# Altium schematic sheet 04_FMC.SchDoc: Power
size A3; Organization: Lime Microsystems; Address1: Surrey Tech Centre; Address2: Guildford GU2 7YG; Address3: Surrey; Address4: United Kingdom; Revision: v1.1; SheetNumber: 12; SheetTotal: 12
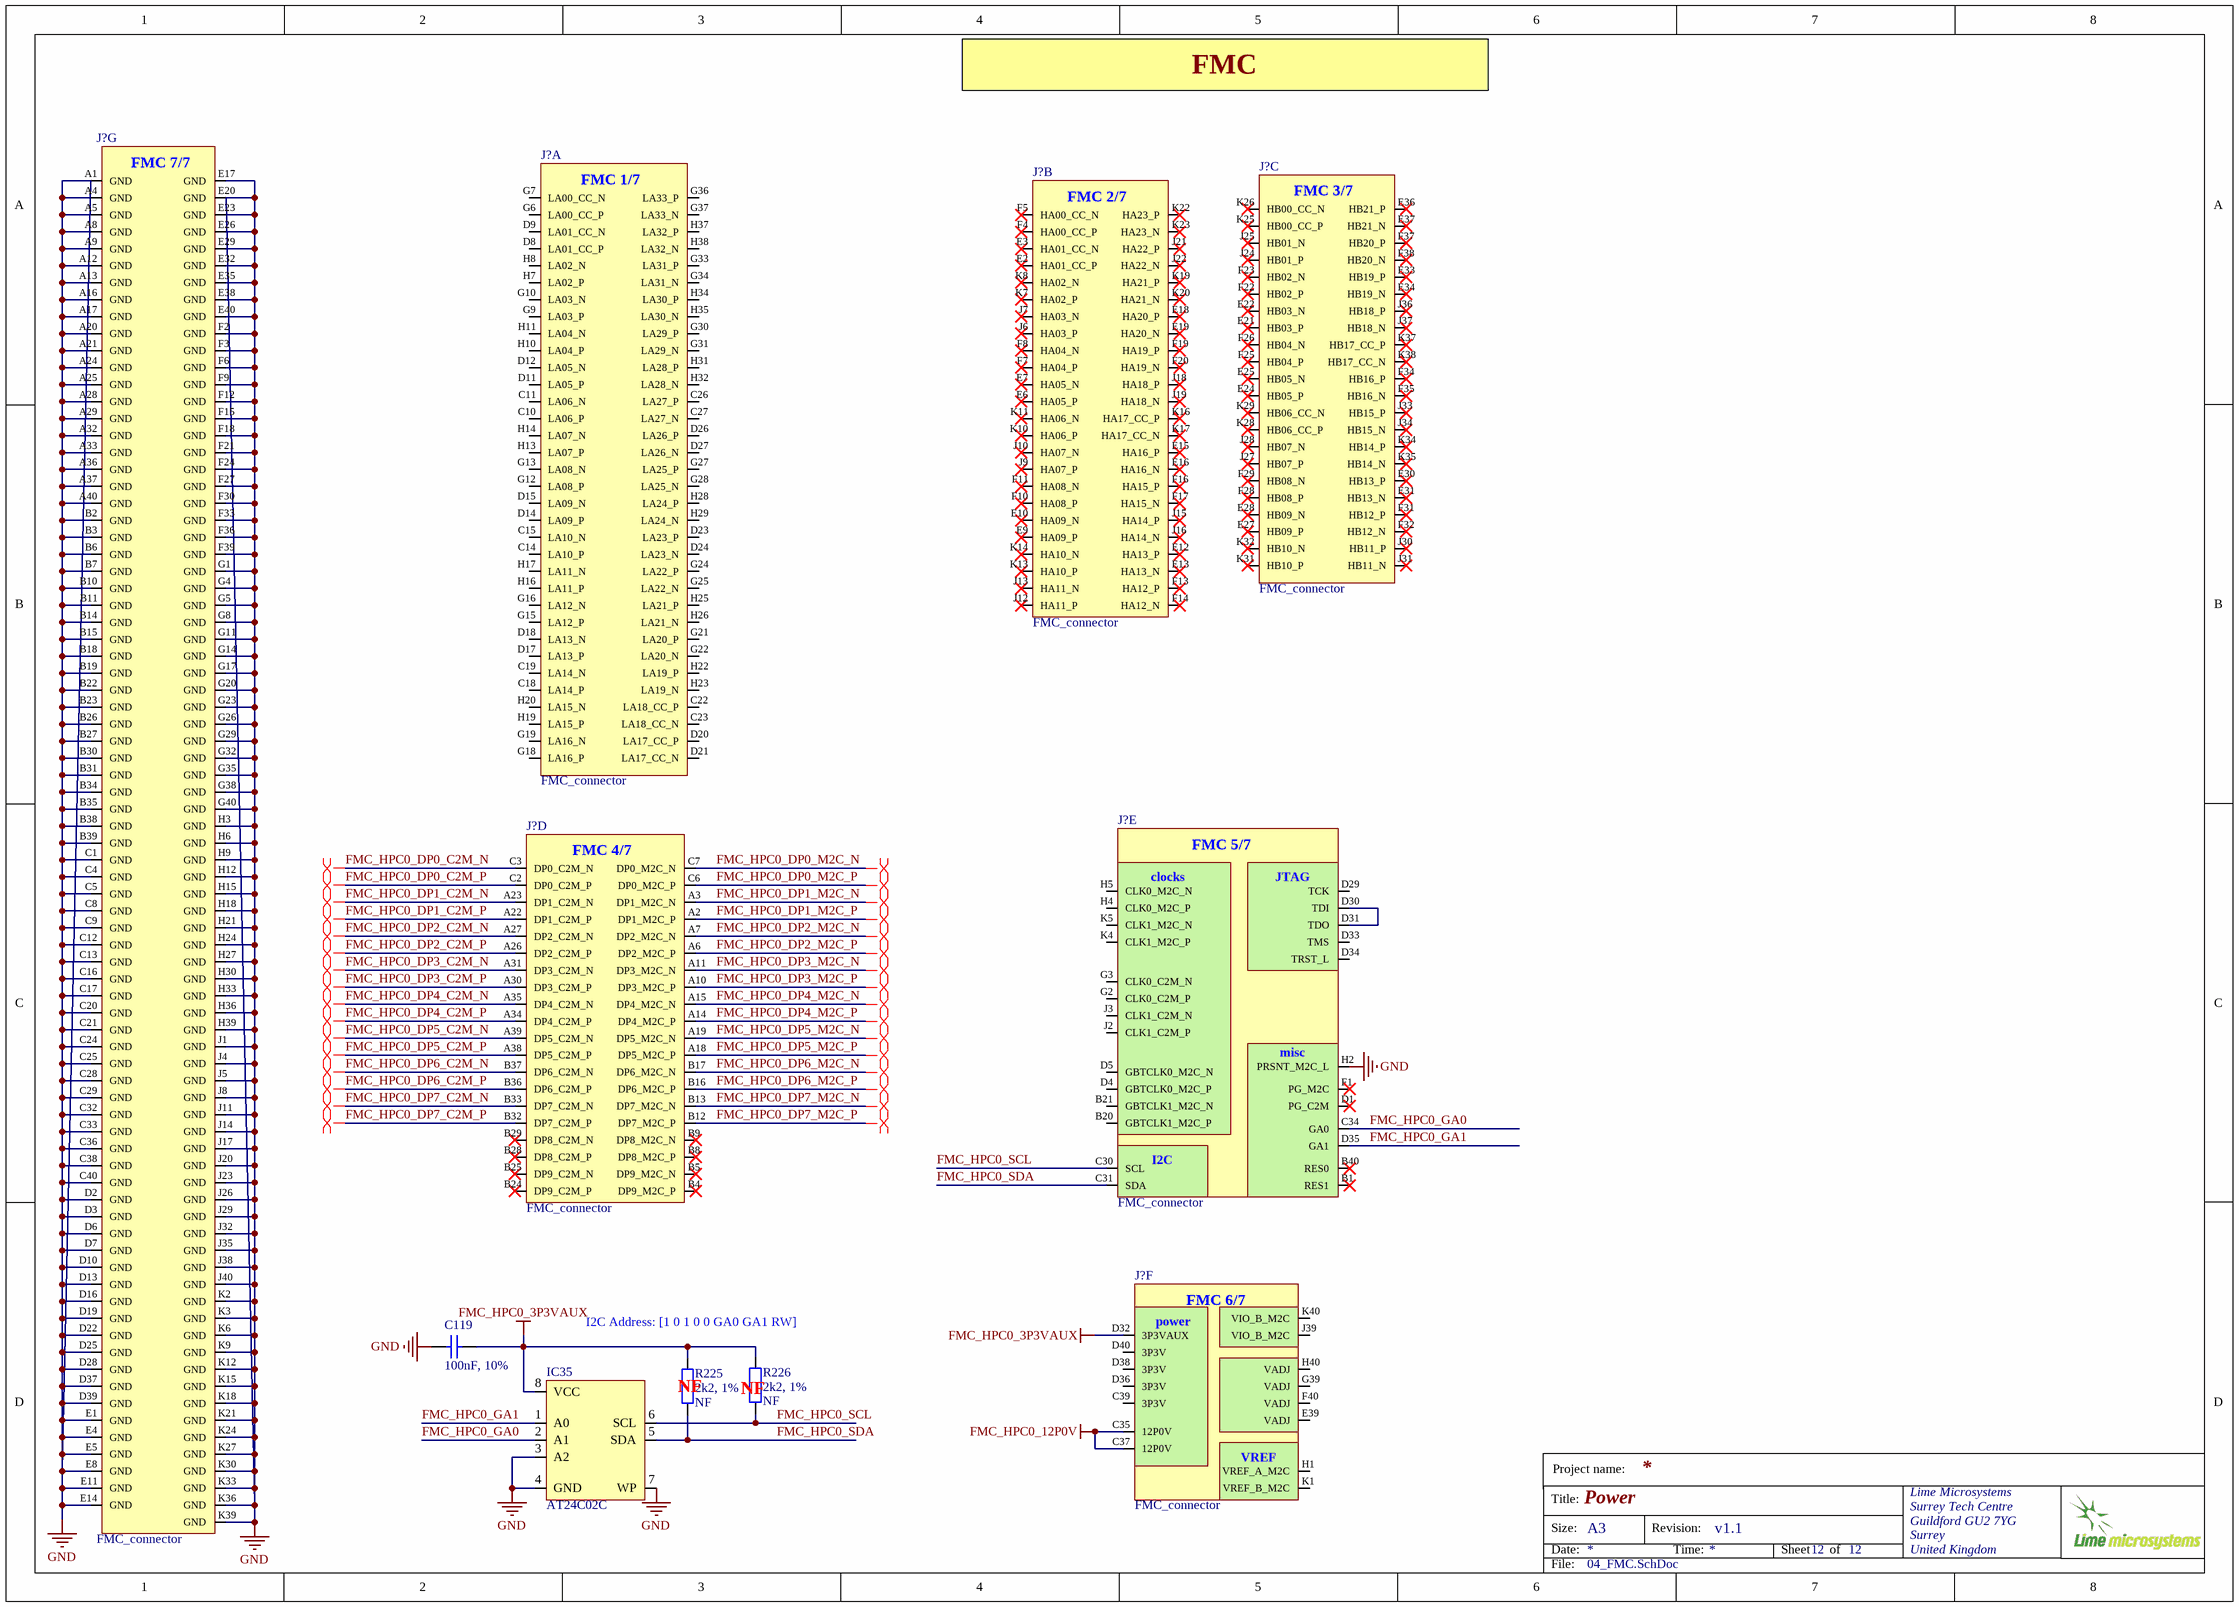
[diagram p0: 04_FMC.SchDoc]

## Parts
(Parts that share a designator on the sheet are numbered #1, #2 ... from top to bottom, then left to right.)
C119  100nF, 10%  [CAP0402]
IC35  AT24C02C  [SOIC127P600-8DL_v2]
J?#1  FMC_connector  [FMC_full_conn]  (part A of 7)
J?#2  FMC_connector  [FMC_full_conn]  (part B of 7)
J?#3  FMC_connector  [FMC_full_conn]  (part C of 7)
J?#4  FMC_connector  [FMC_full_conn]  (part G of 7)
J?#5  FMC_connector  [FMC_full_conn]  (part D of 7)
J?#6  FMC_connector  [FMC_full_conn]  (part E of 7)
J?#7  FMC_connector  [FMC_full_conn]  (part F of 7)
R225  2k2, 1%  Assembly Info: NF  [RES0402]
R226  2k2, 1%  Assembly Info: NF  [RES0402]

## Nets
FMC_HPC0_3P3VAUX: C119.1 IC35.8(VCC) J?#7.D32(3P3VAUX) R225.1 R226.1
FMC_HPC0_12P0V: J?#7.C35(12P0V) J?#7.C37(12P0V)
GND: C119.2 IC35.3(A2) IC35.4(GND) IC35.7(WP) J?#4.A1(GND) J?#4.A4(GND) J?#4.A5(GND) J?#4.A8(GND) J?#4.A9(GND) J?#4.A12(GND) J?#4.A13(GND) J?#4.A16(GND) J?#4.A17(GND) J?#4.A20(GND) J?#4.A21(GND) J?#4.A24(GND) J?#4.A25(GND) J?#4.A28(GND) J?#4.A29(GND) J?#4.A32(GND) J?#4.A33(GND) J?#4.A36(GND) J?#4.A37(GND) J?#4.A40(GND) J?#4.B2(GND) J?#4.B3(GND) J?#4.B6(GND) J?#4.B7(GND) J?#4.B10(GND) J?#4.B11(GND) J?#4.B14(GND) J?#4.B15(GND) J?#4.B18(GND) J?#4.B19(GND) J?#4.B22(GND) J?#4.B23(GND) J?#4.B26(GND) J?#4.B27(GND) J?#4.B30(GND) J?#4.B31(GND) J?#4.B34(GND) J?#4.B35(GND) J?#4.B38(GND) J?#4.B39(GND) J?#4.C1(GND) J?#4.C4(GND) J?#4.C5(GND) J?#4.C8(GND) J?#4.C9(GND) J?#4.C12(GND) J?#4.C13(GND) J?#4.C16(GND) J?#4.C17(GND) J?#4.C20(GND) J?#4.C21(GND) J?#4.C24(GND) J?#4.C25(GND) J?#4.C28(GND) J?#4.C29(GND) J?#4.C32(GND) J?#4.C33(GND) J?#4.C36(GND) J?#4.C38(GND) J?#4.C40(GND) J?#4.D2(GND) J?#4.D3(GND) J?#4.D6(GND) J?#4.D7(GND) J?#4.D10(GND) J?#4.D13(GND) J?#4.D16(GND) J?#4.D19(GND) J?#4.D22(GND) J?#4.D25(GND) J?#4.D28(GND) J?#4.D37(GND) J?#4.D39(GND) J?#4.E1(GND) J?#4.E4(GND) J?#4.E5(GND) J?#4.E8(GND) J?#4.E11(GND) J?#4.E14(GND) J?#4.E17(GND) J?#4.E20(GND) J?#4.E23(GND) J?#4.E26(GND) J?#4.E29(GND) J?#4.E32(GND) J?#4.E35(GND) J?#4.E38(GND) J?#4.E40(GND) J?#4.F2(GND) J?#4.F3(GND) J?#4.F6(GND) J?#4.F9(GND) J?#4.F12(GND) J?#4.F15(GND) J?#4.F18(GND) J?#4.F21(GND) J?#4.F24(GND) J?#4.F27(GND) J?#4.F30(GND) J?#4.F33(GND) J?#4.F36(GND) J?#4.F39(GND) J?#4.G1(GND) J?#4.G4(GND) J?#4.G5(GND) J?#4.G8(GND) J?#4.G11(GND) J?#4.G14(GND) J?#4.G17(GND) J?#4.G20(GND) J?#4.G23(GND) J?#4.G26(GND) J?#4.G29(GND) J?#4.G32(GND) J?#4.G35(GND) J?#4.G38(GND) J?#4.G40(GND) J?#4.H3(GND) J?#4.H6(GND) J?#4.H9(GND) J?#4.H12(GND) J?#4.H15(GND) J?#4.H18(GND) J?#4.H21(GND) J?#4.H24(GND) J?#4.H27(GND) J?#4.H30(GND) J?#4.H33(GND) J?#4.H36(GND) J?#4.H39(GND) J?#4.J1(GND) J?#4.J4(GND) J?#4.J5(GND) J?#4.J8(GND) J?#4.J11(GND) J?#4.J14(GND) J?#4.J17(GND) J?#4.J20(GND) J?#4.J23(GND) J?#4.J26(GND) J?#4.J29(GND) J?#4.J32(GND) J?#4.J35(GND) J?#4.J38(GND) J?#4.J40(GND) J?#4.K2(GND) J?#4.K3(GND) J?#4.K6(GND) J?#4.K9(GND) J?#4.K12(GND) J?#4.K15(GND) J?#4.K18(GND) J?#4.K21(GND) J?#4.K24(GND) J?#4.K27(GND) J?#4.K30(GND) J?#4.K33(GND) J?#4.K36(GND) J?#4.K39(GND) J?#6.H2(PRSNT_M2C_L)
FMC_HPC0_DP0_C2M_N: J?#5.C3(DP0_C2M_N)
FMC_HPC0_DP0_C2M_P: J?#5.C2(DP0_C2M_P)
FMC_HPC0_DP0_M2C_N: J?#5.C7(DP0_M2C_N)
FMC_HPC0_DP0_M2C_P: J?#5.C6(DP0_M2C_P)
FMC_HPC0_DP1_C2M_N: J?#5.A23(DP1_C2M_N)
FMC_HPC0_DP1_C2M_P: J?#5.A22(DP1_C2M_P)
FMC_HPC0_DP1_M2C_N: J?#5.A3(DP1_M2C_N)
FMC_HPC0_DP1_M2C_P: J?#5.A2(DP1_M2C_P)
FMC_HPC0_DP2_C2M_N: J?#5.A27(DP2_C2M_N)
FMC_HPC0_DP2_C2M_P: J?#5.A26(DP2_C2M_P)
FMC_HPC0_DP2_M2C_N: J?#5.A7(DP2_M2C_N)
FMC_HPC0_DP2_M2C_P: J?#5.A6(DP2_M2C_P)
FMC_HPC0_DP3_C2M_N: J?#5.A31(DP3_C2M_N)
FMC_HPC0_DP3_C2M_P: J?#5.A30(DP3_C2M_P)
FMC_HPC0_DP3_M2C_N: J?#5.A11(DP3_M2C_N)
FMC_HPC0_DP3_M2C_P: J?#5.A10(DP3_M2C_P)
FMC_HPC0_DP4_C2M_N: J?#5.A35(DP4_C2M_N)
FMC_HPC0_DP4_C2M_P: J?#5.A34(DP4_C2M_P)
FMC_HPC0_DP4_M2C_N: J?#5.A15(DP4_M2C_N)
FMC_HPC0_DP4_M2C_P: J?#5.A14(DP4_M2C_P)
FMC_HPC0_DP5_C2M_N: J?#5.A39(DP5_C2M_N)
FMC_HPC0_DP5_C2M_P: J?#5.A38(DP5_C2M_P)
FMC_HPC0_DP5_M2C_N: J?#5.A19(DP5_M2C_N)
FMC_HPC0_DP5_M2C_P: J?#5.A18(DP5_M2C_P)
FMC_HPC0_DP6_C2M_N: J?#5.B37(DP6_C2M_N)
FMC_HPC0_DP6_C2M_P: J?#5.B36(DP6_C2M_P)
FMC_HPC0_DP6_M2C_N: J?#5.B17(DP6_M2C_N)
FMC_HPC0_DP6_M2C_P: J?#5.B16(DP6_M2C_P)
FMC_HPC0_DP7_C2M_N: J?#5.B33(DP7_C2M_N)
FMC_HPC0_DP7_C2M_P: J?#5.B32(DP7_C2M_P)
FMC_HPC0_DP7_M2C_N: J?#5.B13(DP7_M2C_N)
FMC_HPC0_DP7_M2C_P: J?#5.B12(DP7_M2C_P)
FMC_HPC0_GA0: IC35.2(A1) J?#6.C34(GA0)
FMC_HPC0_GA1: IC35.1(A0) J?#6.D35(GA1)
FMC_HPC0_SCL: IC35.6(SCL) J?#6.C30(SCL) R226.2
FMC_HPC0_SDA: IC35.5(SDA) J?#6.C31(SDA) R225.2
NetJ?#6_D30: J?#6.D30(TDI) J?#6.D31(TDO)

Not connected (* = marked no-connect by the designer): J?#1 C10(LA06_P) C11(LA06_N) C14(LA10_P) C15(LA10_N) C18(LA14_P) C19(LA14_N) C22(LA18_CC_P) C23(LA18_CC_N) C26(LA27_P) C27(LA27_N) D8(LA01_CC_P) D9(LA01_CC_N) D11(LA05_P) D12(LA05_N) D14(LA09_P) D15(LA09_N) D17(LA13_P) D18(LA13_N) D20(LA17_CC_P) D21(LA17_CC_N) D23(LA23_P) D24(LA23_N) D26(LA26_P) D27(LA26_N) G6(LA00_CC_P) G7(LA00_CC_N) G9(LA03_P) G10(LA03_N) G12(LA08_P) G13(LA08_N) G15(LA12_P) G16(LA12_N) G18(LA16_P) G19(LA16_N) G21(LA20_P) G22(LA20_N) G24(LA22_P) G25(LA22_N) G27(LA25_P) G28(LA25_N) G30(LA29_P) G31(LA29_N) G33(LA31_P) G34(LA31_N) G36(LA33_P) G37(LA33_N) H7(LA02_P) H8(LA02_N) H10(LA04_P) H11(LA04_N) H13(LA07_P) H14(LA07_N) H16(LA11_P) H17(LA11_N) H19(LA15_P) H20(LA15_N) H22(LA19_P) H23(LA19_N) H25(LA21_P) H26(LA21_N) H28(LA24_P) H29(LA24_N) H31(LA28_P) H32(LA28_N) H34(LA30_P) H35(LA30_N) H37(LA32_P) H38(LA32_N); J?#2 E2(HA01_CC_P)* E3(HA01_CC_N)* E6(HA05_P)* E7(HA05_N)* E9(HA09_P)* E10(HA09_N)* E12(HA13_P)* E13(HA13_N)* E15(HA16_P)* E16(HA16_N)* E18(HA20_P)* E19(HA20_N)* F4(HA00_CC_P)* F5(HA00_CC_N)* F7(HA04_P)* F8(HA04_N)* F10(HA08_P)* F11(HA08_N)* F13(HA12_P)* F14(HA12_N)* F16(HA15_P)* F17(HA15_N)* F19(HA19_P)* F20(HA19_N)* J6(HA03_P)* J7(HA03_N)* J9(HA07_P)* J10(HA07_N)* J12(HA11_P)* J13(HA11_N)* J15(HA14_P)* J16(HA14_N)* J18(HA18_P)* J19(HA18_N)* J21(HA22_P)* J22(HA22_N)* K7(HA02_P)* K8(HA02_N)* K10(HA06_P)* K11(HA06_N)* K13(HA10_P)* K14(HA10_N)* K16(HA17_CC_P)* K17(HA17_CC_N)* K19(HA21_P)* K20(HA21_N)* K22(HA23_P)* K23(HA23_N)*; J?#3 E21(HB03_P)* E22(HB03_N)* E24(HB05_P)* E25(HB05_N)* E27(HB09_P)* E28(HB09_N)* E30(HB13_P)* E31(HB13_N)* E33(HB19_P)* E34(HB19_N)* E36(HB21_P)* E37(HB21_N)* F22(HB02_P)* F23(HB02_N)* F25(HB04_P)* F26(HB04_N)* F28(HB08_P)* F29(HB08_N)* F31(HB12_P)* F32(HB12_N)* F34(HB16_P)* F35(HB16_N)* F37(HB20_P)* F38(HB20_N)* J24(HB01_P)* J25(HB01_N)* J27(HB07_P)* J28(HB07_N)* J30(HB11_P)* J31(HB11_N)* J33(HB15_P)* J34(HB15_N)* J36(HB18_P)* J37(HB18_N)* K25(HB00_CC_P)* K26(HB00_CC_N)* K28(HB06_CC_P)* K29(HB06_CC_N)* K31(HB10_P)* K32(HB10_N)* K34(HB14_P)* K35(HB14_N)* K37(HB17_CC_P)* K38(HB17_CC_N)*; J?#5 B4(DP9_M2C_P)* B5(DP9_M2C_N)* B8(DP8_M2C_P)* B9(DP8_M2C_N)* B24(DP9_C2M_P)* B25(DP9_C2M_N)* B28(DP8_C2M_P)* B29(DP8_C2M_N)*; J?#6 B1(RES1)* B20(GBTCLK1_M2C_P) B21(GBTCLK1_M2C_N) B40(RES0)* D1(PG_C2M)* D4(GBTCLK0_M2C_P) D5(GBTCLK0_M2C_N) D29(TCK) D33(TMS) D34(TRST_L) F1(PG_M2C)* G2(CLK0_C2M_P) G3(CLK0_C2M_N) H4(CLK0_M2C_P) H5(CLK0_M2C_N) J2(CLK1_C2M_P) J3(CLK1_C2M_N) K4(CLK1_M2C_P) K5(CLK1_M2C_N); J?#7 C39(3P3V) D36(3P3V) D38(3P3V) D40(3P3V) E39(VADJ) F40(VADJ) G39(VADJ) H1(VREF_A_M2C) H40(VADJ) J39(VIO_B_M2C) K1(VREF_B_M2C) K40(VIO_B_M2C)

## Layout directives
differential pair: FMC_HPC0_DP0_C2M_N, FMC_HPC0_DP0_C2M_P, FMC_HPC0_DP0_M2C_N, FMC_HPC0_DP0_M2C_P, FMC_HPC0_DP1_C2M_N, FMC_HPC0_DP1_C2M_P, FMC_HPC0_DP1_M2C_N, FMC_HPC0_DP1_M2C_P, FMC_HPC0_DP2_C2M_N, FMC_HPC0_DP2_C2M_P, FMC_HPC0_DP2_M2C_N, FMC_HPC0_DP2_M2C_P, FMC_HPC0_DP3_C2M_N, FMC_HPC0_DP3_C2M_P, FMC_HPC0_DP3_M2C_N, FMC_HPC0_DP3_M2C_P, FMC_HPC0_DP4_C2M_N, FMC_HPC0_DP4_C2M_P, FMC_HPC0_DP4_M2C_N, FMC_HPC0_DP4_M2C_P, FMC_HPC0_DP5_C2M_N, FMC_HPC0_DP5_C2M_P, FMC_HPC0_DP5_M2C_N, FMC_HPC0_DP5_M2C_P, FMC_HPC0_DP6_C2M_N, FMC_HPC0_DP6_C2M_P, FMC_HPC0_DP6_M2C_N, FMC_HPC0_DP6_M2C_P, FMC_HPC0_DP7_C2M_N, FMC_HPC0_DP7_C2M_P, FMC_HPC0_DP7_M2C_N, FMC_HPC0_DP7_M2C_P

## Notes on the sheet
- FMC
- I2C Address: [1 0 1 0 0 GA0 GA1 RW]
- (near R225) NF
- (near R226) NF
- Project name:
- Title:
- Size:
- Date:
- A3
- Revision:
- Time:
- Sheet
- of
- File:
- (in symbol FMC_connector, part A) FMC 1/7
- (in symbol FMC_connector, part B) FMC 2/7
- (in symbol FMC_connector, part C) FMC 3/7
- (in symbol FMC_connector, part D) FMC 4/7
- (in symbol FMC_connector, part E) FMC 5/7; clocks /; JTAG /; misc /; I2C /
- (in symbol FMC_connector, part F) FMC 6/7; power /; VREF /
- (in symbol FMC_connector, part G) FMC 7/7

## Library data of the parts
C119 = Cap_0402: Manufacturer: Murata Electronics; Manufacturer Part Number: GRM155R71C104KA88D; Voltage Rating DC: 16 V; Type: General Purpose MLCC; Capacitance: 0.1 uF; Case Length: 1 mm; Dielectric: X7R; Case Height: 0.5 mm; Temperature Coefficient / Code: +/- 15 %; Value: 100nF, 10%; Supplier 1: Mouser; Supplier Part Number 1: 81-GRM155R71C104KA88; Case Code - in: 0402; RoHS: RoHS Compliant; Operating Temperature Range: - 55 C to + 125 C; Series: GRM; Termination Style: SMD/SMT; Tolerance: 10 %; Package / Case: 0402 (1005 metric); Maximum Operating Temperature: + 125 C; Case Code - mm: 1005; Minimum Operating Temperature: - 55 C; Product Category: Low & Medium Capacitance SMD Ceramic Chip Capacitors; Packaging: Reel; Product: General Type MLCCs; Category: Multilayer Ceramic Capacitors MLCC - SMD/SMT; Brand: Murata Electronics; Case Width: 0.5 mm; RoHS - Mouser: Y; Standard Pack Qty: 10000; Minimum Order Quantity: 1; Reeling: True; Manufacturer Part Number 1: GRM155R71C104KA88D
IC35 = AT24C02C-SSHM-B: Manufacturer: ATMEL; Manufacturer Part Number 1: AT24C02C-SSHM-T; Supplier 1: Farnell; Supplier Part Number 1: 2345577
J?#1-J?#7 = FMC_connector: Manufacturer Part Number: ASP-134603-01; Supplier 1: Digi-Key; Category: Connectors, Interconnects; Supplier Part Number: SAM8729-ND
R225 R226 = Res_0402: Manufacturer: Stackpole Electronics Inc; Manufacturer Part Number 1: RMCF0402FT2K20; Resistance (Ohms): 2.2k; Temperature Coefficient: ±100ppm/°C; Power (Watts): 0.063W, 1/16W; Value: 2k2, 1%; Supplier 1: Digi-Key; Supplier Part Number 1: RMCF0402FT2K20CT-ND; Supplier Device Package: 0402; Package / Case: 0402 (1005 Metric); Size / Dimension: 0.039" L x 0.020" W (1.00mm x 0.50mm); Operating Temperature: -55°C ~ 155°C; Composition: Thick Film; Category: Resistors; Features: -; Height: 0.016" (0.40mm); RoHS: RoHS Compliant; Number of Terminations: 2; Packaging: Cut Tape (CT); Tolerance: ±1%